# EAGLE schematic Main Board (EAGLE 6.2)
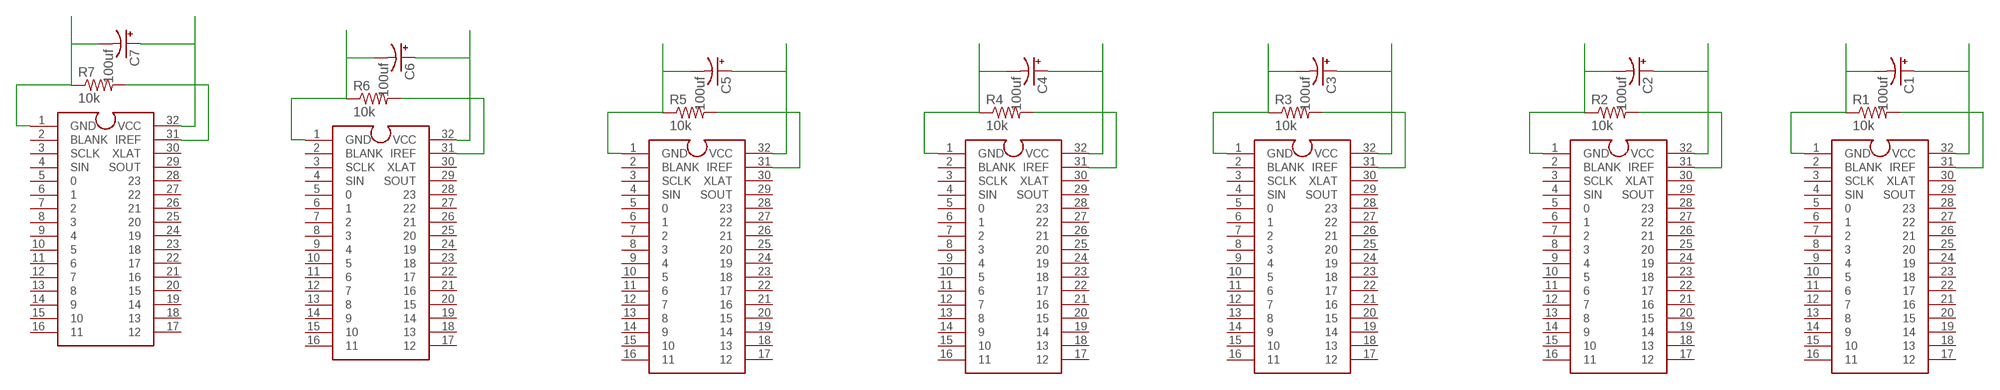
[diagram p0: schematic, sheet 1]

## Parts
C1  100uf  CPOL-USE2.5-6  [E2,5-6]
C2  100uf  CPOL-USE2.5-6  [E2,5-6]
C3  100uf  CPOL-USE2.5-6  [E2,5-6]
C4  100uf  CPOL-USE2.5-6  [E2,5-6]
C5  100uf  CPOL-USE2.5-6  [E2,5-6]
C6  100uf  CPOL-USE2.5-6  [E2,5-6]
C7  100uf  CPOL-USE2.5-6  [E2,5-6]
R1  10k  R-US_0207/10  [0207/10]
R2  10k  R-US_0207/10  [0207/10]
R3  10k  R-US_0207/10  [0207/10]
R4  10k  R-US_0207/10  [0207/10]
R5  10k  R-US_0207/10  [0207/10]
R6  10k  R-US_0207/10  [0207/10]
R7  10k  R-US_0207/10  [0207/10]
U$1  TLC5947DAC  [DAP38]
U$2  TLC5947DAC  [DAP38]
U$3  TLC5947DAC  [DAP38]
U$4  TLC5947DAC  [DAP38]
U$5  TLC5947DAC  [DAP38]
U$6  TLC5947DAC  [DAP38]
U$7  TLC5947DAC  [DAP38]

## Nets
GND: C1.- R1.1 U$1.1(GND)
GND1: C2.- R2.1 U$2.1(GND)
GND2: C3.- R3.1 U$3.1(GND)
GND3: C4.- R4.1 U$4.1(GND)
GND4: C5.- R5.1 U$5.1(GND)
GND5: C6.- R6.1 U$6.1(GND)
GND6: C7.- R7.1 U$7.1(GND)
N$1: R1.2 U$1.31(IREF)
N$2: R2.2 U$2.31(IREF)
N$3: R3.2 U$3.31(IREF)
N$4: R4.2 U$4.31(IREF)
N$5: R5.2 U$5.31(IREF)
N$6: R6.2 U$6.31(IREF)
N$7: R7.2 U$7.31(IREF)
VCC: C1.+ U$1.32(VCC)
VCC1: C2.+ U$2.32(VCC)
VCC2: C3.+ U$3.32(VCC)
VCC3: C4.+ U$4.32(VCC)
VCC4: C5.+ U$5.32(VCC)
VCC5: C6.+ U$6.32(VCC)
VCC6: C7.+ U$7.32(VCC)
Unconnected: U$1.2(BLANK) U$1.3(SCLK) U$1.4(SIN) U$1.5 U$1.6 U$1.7 U$1.8 U$1.9 U$1.10 U$1.11 U$1.12 U$1.13 U$1.14 U$1.15 U$1.16 U$1.17 U$1.18 U$1.19 U$1.20 U$1.21 U$1.22 U$1.23 U$1.24 U$1.25 U$1.26 U$1.27 U$1.28 U$1.29(SOUT) U$1.30(XLAT) U$2.2(BLANK) U$2.3(SCLK) U$2.4(SIN) U$2.5 U$2.6 U$2.7 U$2.8 U$2.9 U$2.10 U$2.11 U$2.12 U$2.13 U$2.14 U$2.15 U$2.16 U$2.17 U$2.18 U$2.19 U$2.20 U$2.21 U$2.22 U$2.23 U$2.24 U$2.25 U$2.26 U$2.27 U$2.28 U$2.29(SOUT) U$2.30(XLAT) U$3.2(BLANK) U$3.3(SCLK) U$3.4(SIN) U$3.5 U$3.6 U$3.7 U$3.8 U$3.9 U$3.10 U$3.11 U$3.12 U$3.13 U$3.14 U$3.15 U$3.16 U$3.17 U$3.18 U$3.19 U$3.20 U$3.21 U$3.22 U$3.23 U$3.24 U$3.25 U$3.26 U$3.27 U$3.28 U$3.29(SOUT) U$3.30(XLAT) U$4.2(BLANK) U$4.3(SCLK) U$4.4(SIN) U$4.5 U$4.6 U$4.7 U$4.8 U$4.9 U$4.10 U$4.11 U$4.12 U$4.13 U$4.14 U$4.15 U$4.16 U$4.17 U$4.18 U$4.19 U$4.20 U$4.21 U$4.22 U$4.23 U$4.24 U$4.25 U$4.26 U$4.27 U$4.28 U$4.29(SOUT) U$4.30(XLAT) U$5.2(BLANK) U$5.3(SCLK) U$5.4(SIN) U$5.5 U$5.6 U$5.7 U$5.8 U$5.9 U$5.10 U$5.11 U$5.12 U$5.13 U$5.14 U$5.15 U$5.16 U$5.17 U$5.18 U$5.19 U$5.20 U$5.21 U$5.22 U$5.23 U$5.24 U$5.25 U$5.26 U$5.27 U$5.28 U$5.29(SOUT) U$5.30(XLAT) U$6.2(BLANK) U$6.3(SCLK) U$6.4(SIN) U$6.5 U$6.6 U$6.7 U$6.8 U$6.9 U$6.10 U$6.11 U$6.12 U$6.13 U$6.14 U$6.15 U$6.16 U$6.17 U$6.18 U$6.19 U$6.20 U$6.21 U$6.22 U$6.23 U$6.24 U$6.25 U$6.26 U$6.27 U$6.28 U$6.29(SOUT) U$6.30(XLAT) U$7.2(BLANK) U$7.3(SCLK) U$7.4(SIN) U$7.5 U$7.6 U$7.7 U$7.8 U$7.9 U$7.10 U$7.11 U$7.12 U$7.13 U$7.14 U$7.15 U$7.16 U$7.17 U$7.18 U$7.19 U$7.20 U$7.21 U$7.22 U$7.23 U$7.24 U$7.25 U$7.26 U$7.27 U$7.28 U$7.29(SOUT) U$7.30(XLAT)

## Library data of the parts
C1-C7 = resistor:CPOL-US: POLARIZED CAPACITOR, American symbol
R1-R7 = resistor:R-US_: RESISTOR, American symbol
U$1-U$7 = RazorConcepts:TLC5947DAC